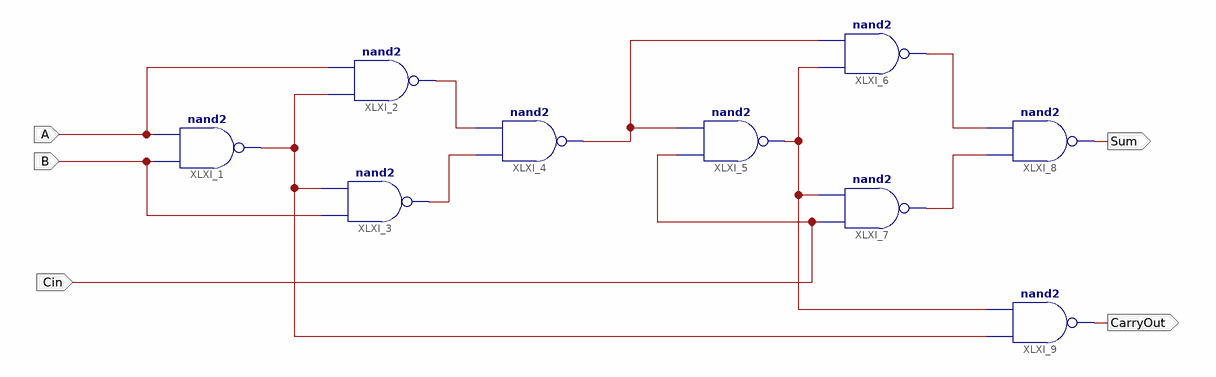
[diagram p0: schematic sheet 1]
// Xilinx ISE schematic Lab4Exp4FA.sch (spartan3e) as structural Verilog: 9 symbols, 5 ports
module Lab4Exp4FA (
  input  A,
  input  B,
  input  Cin,
  output Sum,
  output CarryOut
);

  wire XLXN_8, XLXN_11, XLXN_12, XLXN_14, XLXN_16, XLXN_19, XLXN_20;

  nand XLXI_1 (XLXN_8, B, A);
  nand XLXI_2 (XLXN_11, XLXN_8, A);
  nand XLXI_3 (XLXN_12, B, XLXN_8);
  nand XLXI_4 (XLXN_14, XLXN_12, XLXN_11);
  nand XLXI_5 (XLXN_16, Cin, XLXN_14);
  nand XLXI_6 (XLXN_20, XLXN_16, XLXN_14);
  nand XLXI_7 (XLXN_19, Cin, XLXN_16);
  nand XLXI_8 (Sum, XLXN_19, XLXN_20);
  nand XLXI_9 (CarryOut, XLXN_8, XLXN_16);
endmodule
